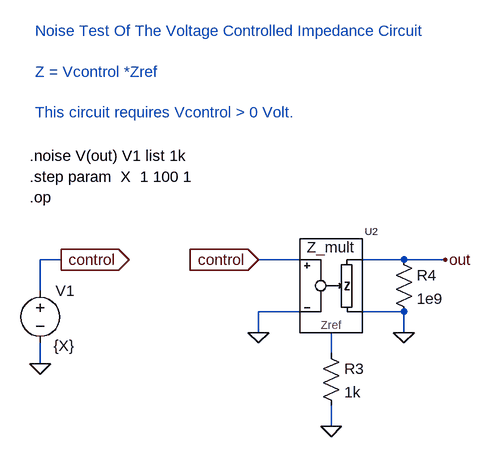
[diagram p0: schematic Mult_Z_test1.asc]
Mult_Z_test1.asc, the LTspice schematic file:
Version 4
SHEET 1 1628 680
WIRE 96 16 64 16
WIRE 464 16 400 16
WIRE 624 16 560 16
WIRE 688 16 624 16
WIRE 64 64 64 16
WIRE 464 96 400 96
WIRE 624 96 560 96
WIRE 400 128 400 96
WIRE 624 128 624 96
WIRE 512 160 512 128
WIRE 64 176 64 144
WIRE 512 272 512 240
FLAG 96 16 control
IOPIN 96 16 Out
FLAG 64 176 0
FLAG 512 272 0
FLAG 624 128 0
FLAG 400 128 0
FLAG 400 16 control
IOPIN 400 16 In
FLAG 688 16 out
SYMBOL voltage 64 48 R0
WINDOW 123 36 114 Left 0
WINDOW 39 0 0 Left 0
WINDOW 3 21 100 Left 0
SYMATTR Value {X}
SYMATTR InstName V1
SYMBOL Z_mult 512 64 R0
SYMATTR InstName U2
SYMBOL res 496 144 R0
SYMATTR InstName R3
SYMATTR Value 1k
SYMBOL res 608 0 R0
SYMATTR InstName R4
SYMATTR Value 1e9
TEXT 56 -336 Left 0 ;Noise Test Of The Voltage Controlled Impedance Circuit\n \nZ = Vcontrol *Zref\n \nThis circuit requires Vcontrol > 0 Volt.
TEXT 48 -144 Left 0 !.noise V(out) V1 list 1k
TEXT 48 -112 Left 0 !.step param  X  1 100 1
TEXT 48 -80 Left 0 !.op

The netlist it stands for:
* Mult_Z_test1.asc
V1 control 0 {X}
XU2 control 0 N001 out 0 Z_mult  ; pins C+ C- Zref Z1 Z2
R3 N001 0 1k
R4 out 0 1e9
* Noise Test Of The Voltage Controlled Impedance Circuit
* Z = Vcontrol *Zref
* This circuit requires Vcontrol > 0 Volt.
.noise V(out) V1 list 1k
.step param  X  1 100 1
.op
.lib Mult_imp_add.sub
.backanno
.end